# EAGLE design SMART LOCK UK (EAGLE 6.4)
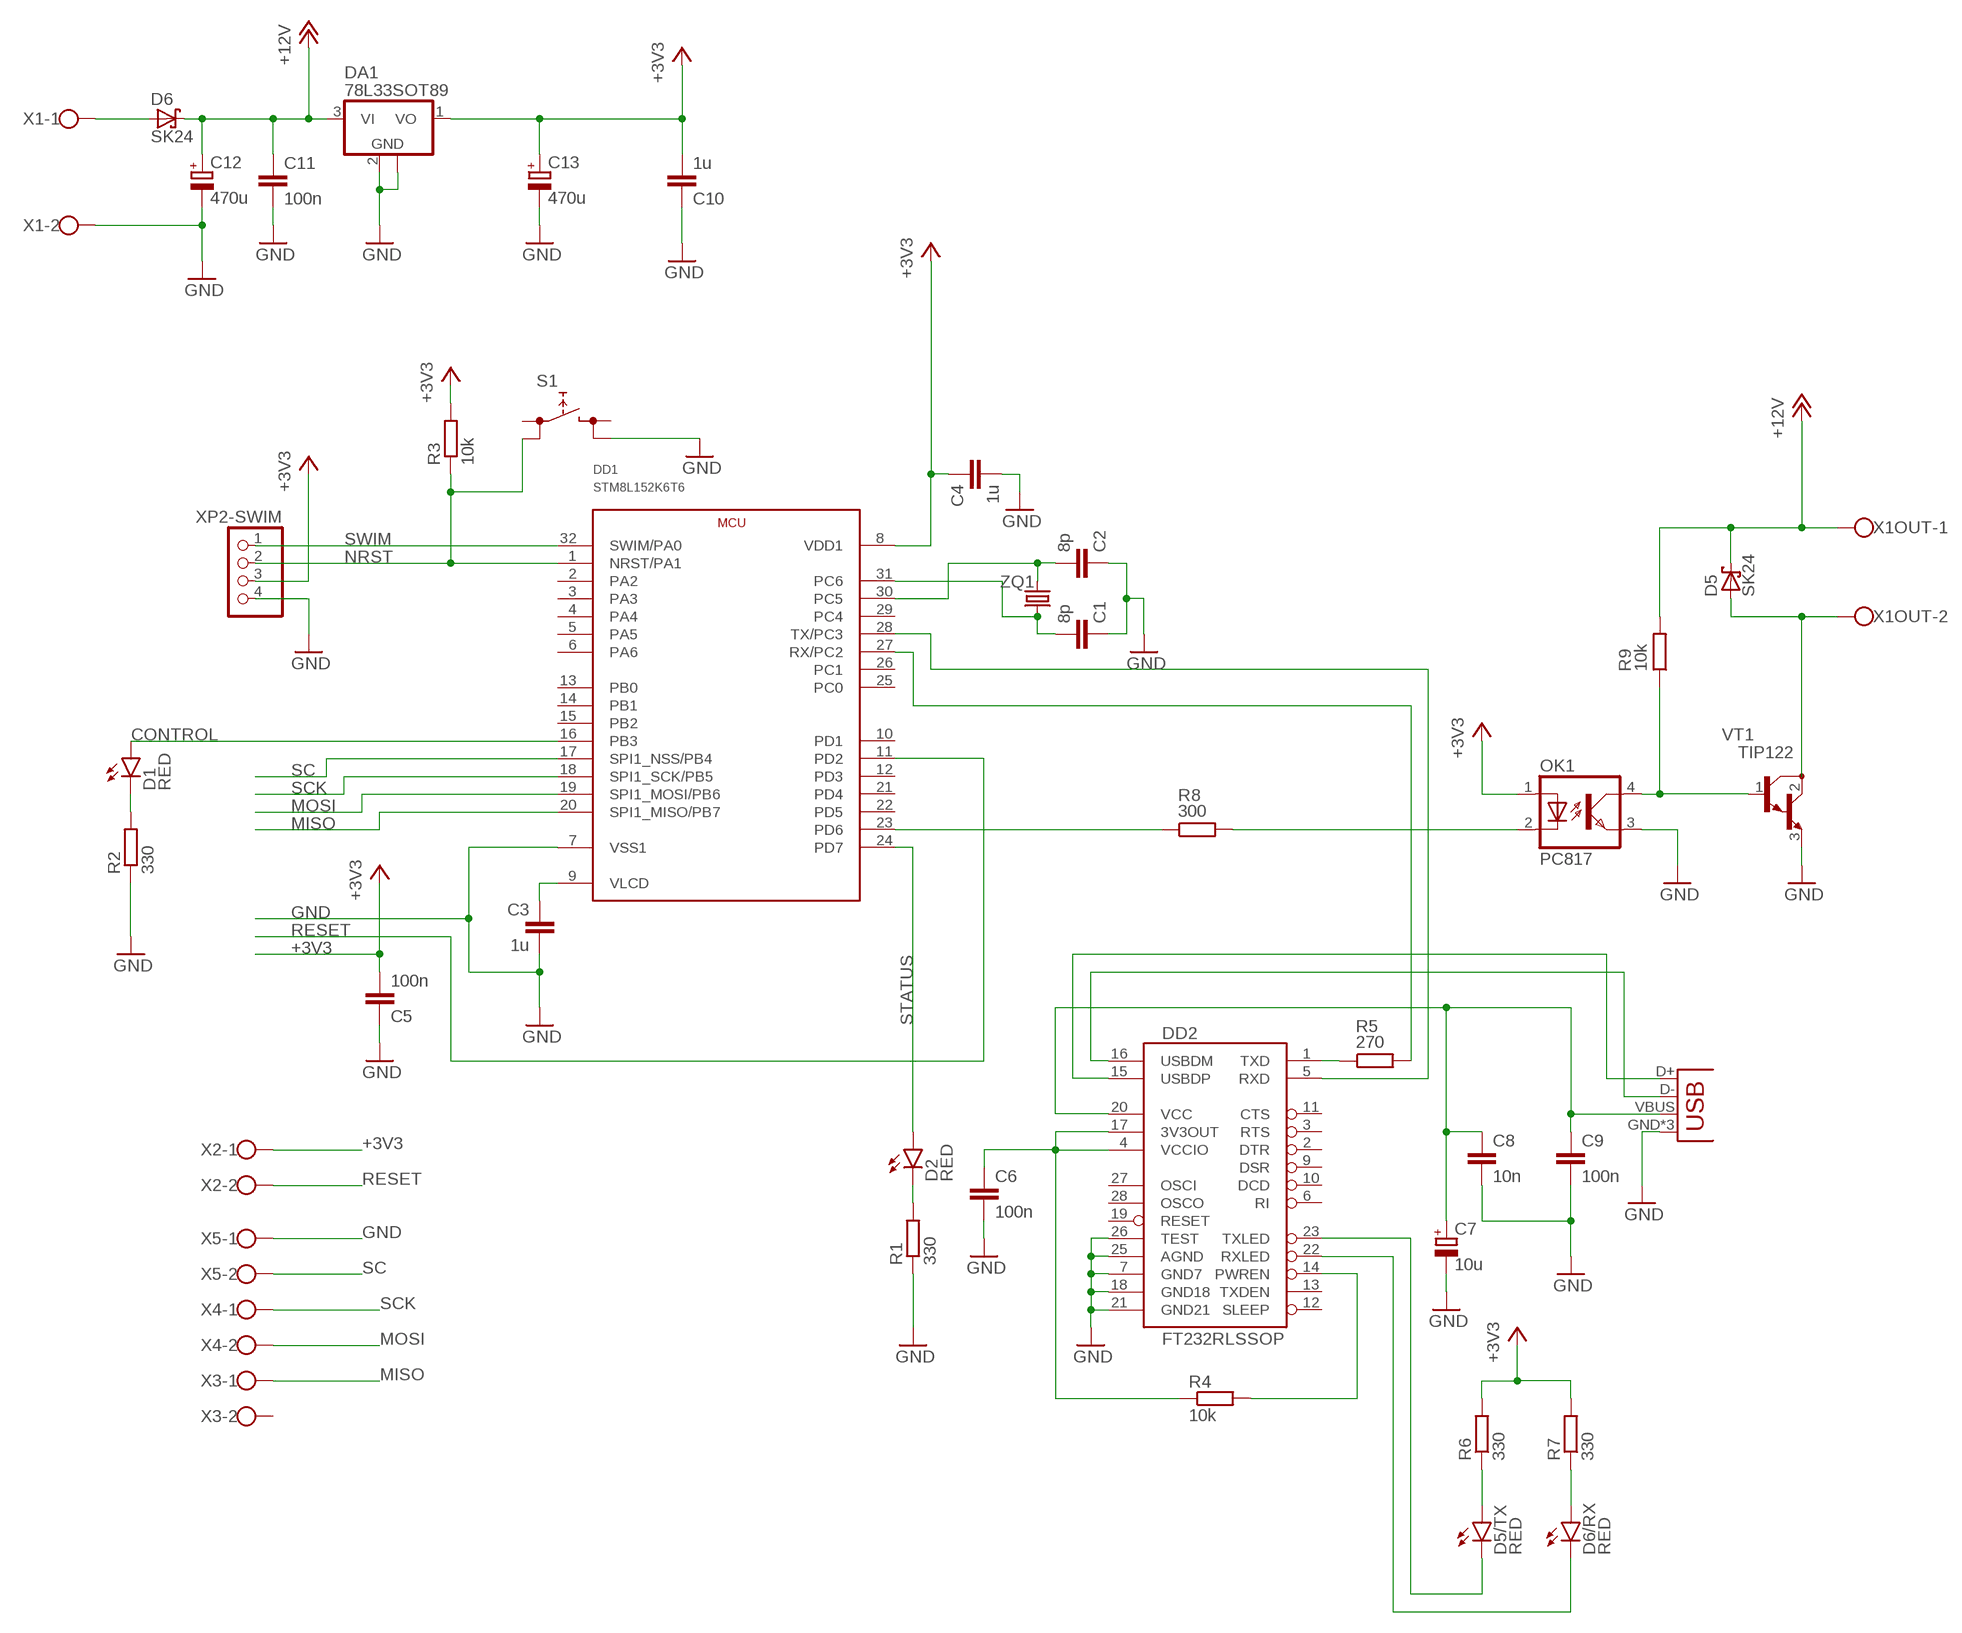
[diagram p0: schematic, sheet 1]

## Parts
C1  8p  C-EUC1206  [C1206]
C2  8p  C-EUC1206  [C1206]
C3  1u  C-EUC1206  [C1206]
C4  1u  C-EUC1206  [C1206]
C5  100n  C-EUC1206  [C1206]
C6  100n  C-EUC1206  [C1206]
C7  10u  CPOL-EUE2,5-5  [E2,5-5]
C8  10n  C-EUC1206  [C1206]
C9  100n  C-EUC1206  [C1206]
C10  1u  C-EUC1206  [C1206]
C11  100n  C-EUC1206  [C1206]
C12  470u  CPOL-EUE3,5-8  [E3,5-8]
C13  470u  CPOL-EUE3,5-8  [E3,5-8]
D1  RED  LED-RED1206  [LED-1206]
D2  RED  LED-RED1206  [LED-1206]
D5  SK24  SCHOTTKY-DIODESMD  [SMB]
D5/TX  RED  LED-RED1206  [LED-1206]
D6  SK24  SCHOTTKY-DIODESMD  [SMB]
D6/RX  RED  LED-RED1206  [LED-1206]
DA1  78L33SOT89  [SOT89]
DD1  STM8L152K6T6  [LQFP32-7X7]
DD2  FT232RLSSOP  [SSOP28DB]
JP1  USB-B  USB-B-CROW  [USB-B-PTH]
OK1  PC817  [DIL04]
R1  330  R-EU_LM1206  [M1206]
R2  330  R-EU_LM1206  [M1206]
R3  10k  R-EU_LM1206  [M1206]
R4  10k  R-EUM1206  [M1206]
R5  270  R-EUM1206  [M1206]
R6  330  R-EU_LM1206  [M1206]
R7  330  R-EU_LM1206  [M1206]
R8  300  R-EUM1206  [M1206]
R9  10k  R-EUM1206  [M1206]
S1  TACKT_SW_TH  [TL1105]
VT1  TIP122  [TO220]
X1  W237-102  [W237-102]
X1OUT  W237-102  [W237-102]
X2  DG350-3.5-02P  [DG350-3.5-02P]
X3  DG350-3.5-02P  [DG350-3.5-02P]
X4  DG350-3.5-02P  [DG350-3.5-02P]
X5  DG350-3.5-02P  [DG350-3.5-02P]
XP2-SWIM  PINHD-1X4  [1X04]
ZQ1  CRYSTAL1MM20SS  [MM20SS]

## Nets
+3V3: C4.1 C5.2 C10.2 C13.+ DA1.1(VO) DD1.8(VDD1) OK1.1(A) R3.2 R6.2 R7.2 X2.1 XP2-SWIM.3
+12V: C11.1 C12.+ D5.C D6.C DA1.3(VI) R9.2 X1OUT.1
CONTROL: D1.A DD1.16(PB3)
GND: C1.1 C2.1 C3.2 C4.2 C5.1 C6.2 C7.- C8.2 C9.2 C10.1 C11.2 C12.- C13.- DA1.2(GND) DA1.2@1(GND) DD1.7(VSS1) DD2.7(GND7) DD2.18(GND18) DD2.21(GND21) DD2.25(AGND) DD2.26(TEST) JP1.GND JP1.S1(GND) JP1.S2(GND) OK1.3(EMIT) R1.1 R2.1 S1.4 VT1.3(E) X1.2 X5.1 XP2-SWIM.4
MISO: DD1.20(SPI1_MISO/PB7) X3.1
MOSI: DD1.19(SPI1_MOSI/PB6) X4.2
N$1: DD1.28(TX/PC3) DD2.5(RXD)
N$2: C1.2 DD1.31(PC6) ZQ1.1
N$3: C3.1 DD1.9(VLCD)
N$6: D5/TX.A R6.1
N$7: D6/RX.A R7.1
N$8: D5/TX.C DD2.23(TXLED)
N$9: D6/RX.C DD2.22(RXLED)
N$10: D5.A VT1.2(C) X1OUT.2
N$11: D2.C R1.2
N$12: D1.C R2.2
N$13: OK1.4(COL) R9.1 VT1.1(B)
N$14: OK1.2(C) R8.2
N$15: DD1.23(PD6) R8.1
N$16: D6.A X1.1
N$17: C7.+ C8.1 C9.1 DD2.20(VCC) JP1.VBUS
N$18: DD1.27(RX/PC2) R5.2
N$19: C2.2 DD1.30(PC5) ZQ1.4
N$25: DD2.16(USBDM) JP1.D-
N$26: DD2.15(USBDP) JP1.D+
N$27: C6.1 DD2.4(VCCIO) DD2.17(3V3OUT) R4.1
N$29: DD2.14(PWREN) R4.2
N$30: DD2.1(TXD) R5.1
NRST: DD1.1(NRST/PA1) R3.1 S1.3 XP2-SWIM.2
RESET: DD1.11(PD2) X2.2
SC: DD1.17(SPI1_NSS/PB4) X5.2
SCK: DD1.18(SPI1_SCK/PB5) X4.1
STATUS: D2.A DD1.24(PD7)
SWIM: DD1.32(SWIM/PA0) XP2-SWIM.1
Unconnected: DD1.2(PA2) DD1.3(PA3) DD1.4(PA4) DD1.5(PA5) DD1.6(PA6) DD1.10(PD1) DD1.12(PD3) DD1.13(PB0) DD1.14(PB1) DD1.15(PB2) DD1.21(PD4) DD1.22(PD5) DD1.25(PC0) DD1.26(PC1) DD1.29(PC4) DD2.2(DTR) DD2.3(RTS) DD2.6(RI) DD2.9(DSR) DD2.10(DCD) DD2.11(CTS) DD2.12(SLEEP) DD2.13(TXDEN) DD2.19(RESET) DD2.27(OSCI) DD2.28(OSCO) S1.1 S1.2 X3.2

## Library data of the parts
C1-C5 C10 = SMART LOCK UK:C-EU
C6 C8 C9 C11 = CondAdapt:C-EU
C7 C12 C13 = LAMP_RES:CPOL-EU
D1 D2 D5/TX D6/RX = SMART LOCK UK:LED-RED: Assorted Red LEDs LilyPad 1206- DIO-09912 1206- DIO-00809 0603- DIO-00819; PROD_ID: DIO-00809
D5 D6 = NOVOSIB:SCHOTTKY-DIODE: Schottky Diode
DA1 = SMART LOCK UK:78L33SOT89
DD1 = SMART LOCK UK:STM8L152K6T6
DD2 = Bullet_cont_prom:FT232RL: USB UART FT232RL 4th Generation USB UART (USB <-> Serial) Controller. Spark Fun Electronics SKU : COM-00650 Production SKU IC-00870; PROD_ID: IC-00870
JP1 = Bullet_cont_prom:USB-B-CROW
OK1 = SMART LOCK UK:PC817: SHARP OPTO COUPLER; MPN: PC817X4J000F; OC_FARNELL: 9707727; OC_NEWARK: 97K7059
R1-R3 R6 R7 = SMART LOCK UK:R-EU_L: RESISTOR, European symbol
R4 R5 R8 R9 = CondAdapt:R-EU: RESISTOR, European symbol
S1 = SMART LOCK UK:TACKT_SW: PUSH SWITCH ITT-Cannon-Cannon
VT1 = SMART LOCK UK:TIP122: NPN BIPOLAR DARLINGTON TRANSISTOR
X1 X1OUT = SMART LOCK UK:W237-102: WAGO SCREW CLAMP; MPN: 237-102; OC_FARNELL: unknown; OC_NEWARK: 70K9898
X2-X5 = LASER_CONTROL_LIB:DG350-3.5-02P: WAGO SCREW CLAMP; MPN: 237-102; OC_FARNELL: unknown; OC_NEWARK: 70K9898
XP2-SWIM = SMART LOCK UK:PINHD-1X4: PIN HEADER
ZQ1 = SMART LOCK UK:CRYSTAL1: CRYSTAL; OC_FARNELL: unknown; OC_NEWARK: unknown

## Board
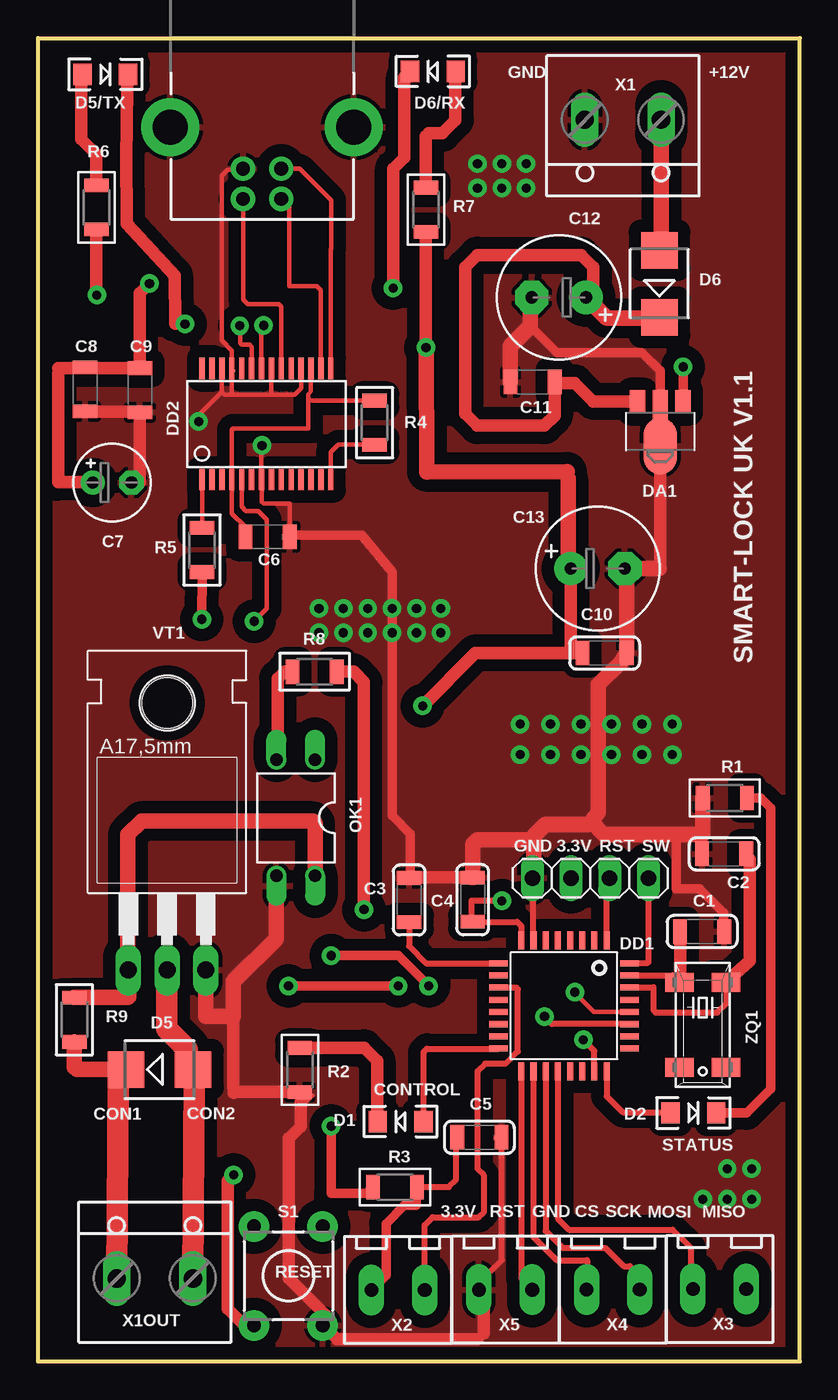
[diagram p1: board, top side]
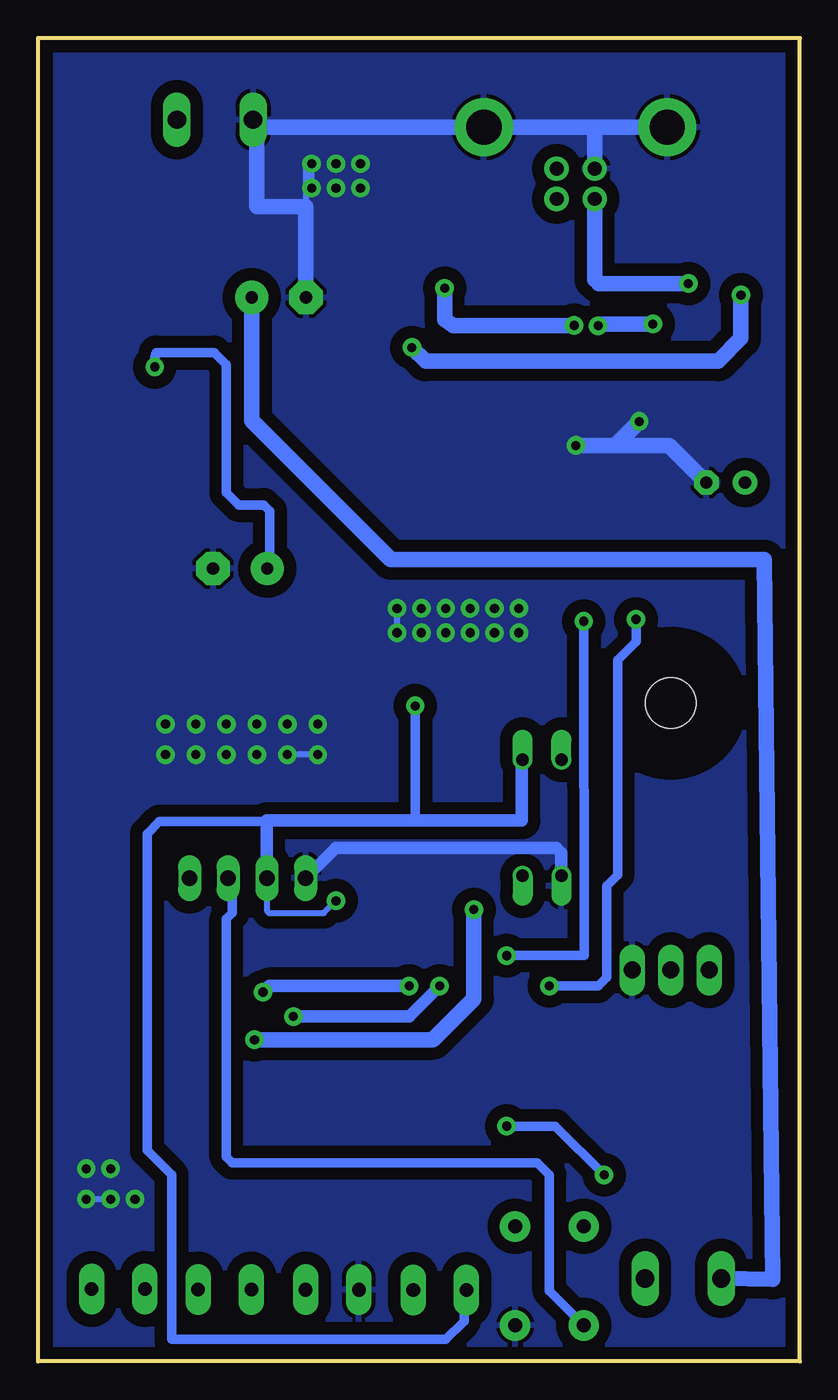
[diagram p2: board, bottom side, seen from below]

Size 50 x 86.9 mm. Coordinates in mm from the lower left corner, seen from the top.
Outline: 0,0 50,0 50,86.9 0,86.9 0,0
Copper layers (1*16): Top 0.035mm / dielectric 1.5mm / Bottom 0.035mm
Design rules "default *": minimum track width 0.25mm, minimum drill 15mil, track to track 8mil, track to pad 8mil, pad to pad 8mil, via to via 8mil, smd to smd 8mil, copper to edge 28mil, drill to drill 28mil, minimum pad ring 10mil, minimum via ring 12mil, stop-mask expansion 4mil, vias tented up to drill 0mil, thermal gap 10mil

### Footprints (pad centres in the part's own frame; a part is rotated, then mirrored left to right if it is on the bottom)
C1206 = smd 0.9 x 1.6: 1 -1.45,0; 2 1.45,0
E2,5-5 = drill 0.8 pad 1.6: + -1.27,0 | drill 0.8 pad 1.6 octagon: - 1.27,0
E3,5-8 = drill 0.8 pad 2.184: + -1.778,0 | drill 0.8 pad 2.184 octagon: - 1.778,0
LED-1206 = smd 1.2 x 1.4: A -1.5,0; C 1.5,0
SMB = smd 2.4 x 2.4: A 2.2,0; C -2.2,0
SOT89 = smd 1 x 1.5: 1 -1.499,-1.981; 3 1.499,-1.981 | smd 1 x 2: 2 0,-1.727 | smd 2.2 x 3.7: 2@1 0,0.94
LQFP32-7X7 = smd 1.2 x 0.4: 1 -4.3,2.8; 2 -4.3,2; 3 -4.3,1.2; 4 -4.3,0.4; 5 -4.3,-0.4; 6 -4.3,-1.2; 7 -4.3,-2; 8 -4.3,-2.8; 17 4.3,-2.8; 18 4.3,-2; 19 4.3,-1.2; 20 4.3,-0.4; 21 4.3,0.4; 22 4.3,1.2; 23 4.3,2; 24 4.3,2.8 | smd 0.4 x 1.2: 9 -2.8,-4.3; 10 -2,-4.3; 11 -1.2,-4.3; 12 -0.4,-4.3; 13 0.4,-4.3; 14 1.2,-4.3; 15 2,-4.3; 16 2.8,-4.3; 25 2.8,4.3; 26 2,4.3; 27 1.2,4.3; 28 0.4,4.3; 29 -0.4,4.3; 30 -1.2,4.3; 31 -2,4.3; 32 -2.8,4.3
SSOP28DB = smd 0.348 x 1.397: 1 -4.225,-3.656; 2 -3.575,-3.656; 3 -2.925,-3.656; 4 -2.275,-3.656; 5 -1.625,-3.656; 6 -0.975,-3.656; 7 -0.325,-3.656; 8 0.325,-3.656; 9 0.975,-3.656; 10 1.625,-3.656; 11 2.275,-3.656; 12 2.925,-3.656; 13 3.575,-3.656; 14 4.225,-3.656; 15 4.225,3.656; 16 3.575,3.656; 17 2.925,3.656; 18 2.275,3.656; 19 1.625,3.656; 20 0.975,3.656; 21 0.325,3.656; 22 -0.325,3.656; 23 -0.975,3.656; 24 -1.625,3.656; 25 -2.275,3.656; 26 -2.925,3.656; 27 -3.575,3.656; 28 -4.225,3.656
USB-B-PTH = drill 0.9 pad 1.6: D+ 0,1.25; D- 1.981,1.25; GND 0,-1.25; VBUS 1.981,-1.25 | drill 2.3 pad 3.81: S1 -2.718,-6.02; S2 -2.718,6.02
DIL04 = drill 0.813 offset: 1 -1.27,-3.81; 2 1.27,-3.81; 3 1.27,3.81; 4 -1.27,3.81
M1206 = smd 0.9 x 1.6: 1 -1.45,0; 2 1.45,0
TL1105 = drill 0.9 pad 2: 1 -2.25,3.25; 2 2.25,3.25; 3 -2.25,-3.25; 4 2.25,-3.25
TO220 = drill 1.118 long: 1 -2.54,-6.35; 2 0,-6.35; 3 2.54,-6.35 | hole 3.302: 0,11.176
W237-102 = drill 1.2 long: 1 -2.5,-1.27; 2 2.5,-1.27
DG350-3.5-02P = drill 0.9 pad 1.676 long: 1 -1.75,0; 2 1.75,0
1X04 = drill 1.016 long: 1 -3.81,0; 2 -1.27,0; 3 1.27,0; 4 3.81,0
MM20SS = smd 1.27 x 1.88: 1 -2.794,-1.524; 2 2.794,-1.524; 3 2.794,1.524; 4 -2.794,1.524

### Placement (x,y rotation side)
C1  43.59,28.23 180 top
C2  45.04,33.33 0 top
C3  24.36,30.3 90 top
C4  28.53,30.32 90 top
C5  28.97,14.72 180 top
C6  15.07,54.15 0 top
C7  4.86,57.71 0 top
C8  3.09,63.83 270 top
C9  6.69,63.78 270 top
C10  37.19,46.52 180 top
C11  32.46,64.32 180 top
C12  34.19,69.87 180 top
C13  36.74,52.07 0 top
D1  23.8,15.75 180 top
D2  43.01,16.32 0 top
D5  7.98,19.17 0 top
D5/TX  4.41,84.52 0 top
D6  40.79,70.77 90 top
D6/RX  25.92,84.71 180 top
DA1  40.84,61.05 180 top
DD1  34.52,23.35 270 top
DD2  14.99,61.56 0 top
JP1  14.71,78.32 270 top
OK1  16.92,35.7 180 top
R1  45.08,37 0 top
R2  17.18,19.14 90 top
R3  23.43,11.45 0 top
R4  22.09,61.64 270 top
R5  10.76,53.29 270 top
R6  3.83,75.78 270 top
R7  25.46,75.63 270 top
R8  18.15,45.3 180 top
R9  2.38,22.44 270 top
S1  16.43,5.62 0 top
VT1  8.47,32.05 0 top
X1  38.39,80.27 180 top
X1OUT  7.66,6.72 0 top
X2  23.63,4.69 0 top
X3  44.74,4.76 0 top
X4  37.75,4.72 0 top
X5  30.69,4.71 0 top
XP2-SWIM  36.25,31.74 180 top
ZQ1  43.63,22.1 270 top

### Tracks (layer width: path | path; a pad name or v marks a point on that pad's centre or on a via)
+3V3  (via drill 0.6)
  Top 0.25: 24.84,11.45 R3.2
  Top 0.305: 3.83,70.06 v3.86,70.03 | v25.47,66.57 v25.46,66.58 | 34.86,58.46 34.79,57.96 | 34.79,52.24 C13.+
  Top 0.406: v25.46,66.58 25.49,66.56 | 34.73,58.43 34.79,57.96 | DD1.8 31.72,28.59 31.44,28.87 C4.1 28.44,28.96 28.44,30.25 v30.44,30.25 | 24.79,11.36 R3.2 26.96,11.45 27.44,11.93 27.44,14.64 C5.2 | 34.96,46.5 C10.2
  Top 0.61: DA1.1 42.34,64.95 v42.34,65.31 | R3.2 24.84,11.41 24.84,10.25 24.04,10.25 22.84,9.05 22.84,5.65 X2.1
  Top 0.813: R6.2 3.83,70.06 | v25.46,66.58 R7.2 | C13.+ 34.96,46.5 | C10.2 28.71,46.52 v25.24,43.05
  Top 1.016: 34.79,57.96 34.79,52.24 | 25.49,66.56 25.52,58.41 34.73,58.43 | C13.+ 34.64,52.07
  Bottom 0.25: OK1.1 18.44,39.45 18.24,39.45 | 35.24,35.45 34.98,35.51
  Bottom 0.406: 25.24,35.91 25.64,35.51 | XP2-SWIM.3 34.98,29.59 34.84,29.45 31.24,29.45 v30.44,30.25
  Bottom 0.61: v42.34,65.31 42.34,65.88 42.25,66.25 38.44,66.25 37.64,65.45 37.64,57.05 36.84,56.25 35.19,56.25 34.79,55.85 34.79,52.24 C13.+ | v25.24,43.05 25.24,35.91 | 35.24,35.45 42.04,35.45 42.84,34.65 42.84,13.85 41.24,12.25 41.24,1.45 23.24,1.45 22.04,2.65 22.04,4.53 X2.1
  Bottom 0.813: XP2-SWIM.3 34.98,35.51 25.64,35.51 19.16,35.51 18.24,35.52 18.24,39.45 18.24,39.46
  Bottom 1.016: v3.86,70.03 3.86,67.18 5.36,65.68 24.56,65.68 v25.46,66.58
+12V
  Top 0.305: 37.65,68.51 37.64,68.52 | C11.1
  Top 0.61: 5.25,18.64 D5.C | 2.54,19.17 2.39,19.32 | R9.2 | 41.64,67.72 D6.C | 36.44,70.34 C12.+
  Top 0.813: 40.74,68.52 D6.C | 36.44,70.34 36.44,71.85 35.64,72.65 28.84,72.65 28.04,71.85 28.04,62.25 28.84,61.45 33.24,61.45 33.91,62.12 C11.1 33.98,64.25 35.24,64.25 36.46,63.03 DA1.3
  Top 1.016: D5.C 2.54,19.17 | 2.39,19.32 R9.2 | 40.74,68.52 37.64,68.52 37.32,68.52 C12.+
  Top 1.422: X1OUT.1 5.25,18.64
  Bottom 1.016: C12.+ 35.97,61.78 26.84,52.65 2.33,52.65 1.79,5.39 X1OUT.1
CONTROL
  Top 0.406: D1.A 25.3,20.32 25.52,20.54 DD1.16
GND  (via drill 0.6)
  Top 0.25: 30.04,14.65 C5.1 | 16.84,54.25 C6.2 | 24.04,31.85 C3.2 | 18.04,17.45 17.64,17.45 17.24,17.45 R2.1 | 12.72,65.05 12.84,65.05 DD2.25 | 18.84,2.65 S1.4
  Top 0.305: 32.44,69.84 C12.- 32.32,69.78 | 24.38,31.77 C3.2 | C6.2 16.52,56.31 16.51,56.32 14.82,56.32 14.67,56.42 14.67,57.85 DD2.7 14.66,60.12 | DD2.26 12.06,63.67 | 12.06,63.67 12.23,63.5 12.83,63.5 | 12.83,63.5 15.31,63.5 | 15.31,63.5 16.86,63.5 17.27,63.93 17.27,65.17 DD2.18 | 12.72,65.2 12.72,65.05 12.72,63.63 12.83,63.5 | DD2.21 15.31,63.51 15.31,63.5 | v10.54,61.72 10.54,62.14 12.06,63.67 | DD2.25 12.71,66.38 12.04,67.05 12.04,77.85 12.44,78.25 13.39,78.25 JP1.GND
  Top 0.406: C9.2 6.69,62.38 | 12.9,17.69 12.86,17.65 | DD1.7 32.52,31.66 XP2-SWIM.4 | S1.4 18.72,2.37 | 28.84,1.45 29.24,1.85 | 24.44,31.83 C3.2 | X5.1 28.94,5.15 30.44,6.65 30.44,14.7 C5.1
  Top 0.61: 36.31,35.45 36.12,35.25 | 32.55,34.51 32.55,34.25 | 32.41,31.77 XP2-SWIM.4 | C1.1 45.02,28.25 45.02,29.44 43.44,31.02 41.88,31.02 41.88,34.62 | C2.1 43.63,34.62 | 12.84,17.63 12.86,17.65 | 6.69,57.71 C7.- | 40.84,52.12 40.79,52.07 | DA1.2@1 DA1.2 40.84,65.05 39.64,66.25 34.04,66.25 32.32,67.97 | 16.84,54.25 21.24,54.25 23.24,51.85 v23.24,49.45 v23.24,47.85 23.24,35.85 24.44,34.65 24.44,31.83
  Top 0.813: C9.2 6.69,57.71 | 6.69,62.38 C8.2 | 32.55,31.85 XP2-SWIM.4 | C4.2 24.38,31.77 | R2.1 12.9,17.69 | 12.86,17.65 12.82,18.21 12.83,22.66 | DA1.2@1 40.84,52.12 | 18.72,2.37 19.64,1.45 28.84,1.45 | 29.24,1.85 29.24,4.41 X5.1 | 18.84,2.65 18.84,3.05 16.44,5.45 16.44,14.65 17.24,15.45 17.24,17.05 17.64,17.45
  Top 1.016: 40.79,52.07 C13.- 38.64,51.95 C10.1 38.24,45.9 36.78,44.44 36.78,36.04 36.31,35.45 37.14,34.62 41.88,34.62 43.63,34.62 R1.1 | OK1.3 15.65,28 15.64,27.99 15.64,27.76 12.83,24.95 12.83,22.66 | 36.12,35.25 33.29,35.25 32.55,34.51 | 32.55,31.85 32.55,34.25 28.84,34.25 28.53,33.94 C4.2 | C11.2 31.01,66.66 32.32,67.97 32.32,69.78 | VT1.3 11.01,22.66 12.83,22.66 | 12.83,22.66
  Bottom 0.406: 13.46,80.86 13.64,81.04 | v31.64,39.85 v33.64,39.85 | v26.44,49.45 v26.44,47.85 | v45.24,10.65 v46.84,10.65 | v32.04,77.05 v32.04,78.65 32.44,78.65 32.44,75.85
  Bottom 0.813: OK1.3 15.65,33.38 15.99,33.72 30.46,33.72 XP2-SWIM.4
  Bottom 1.016: 36.19,81.24 X1.2 | C7.- 8.57,60.15 v14.7,60.15 12.11,60.15 v10.54,61.72 | C12.- 32.44,69.87 32.44,75.84 35.63,75.84 35.64,75.85 35.64,81.29 X1.2 | JP1.S1 13.64,81.04 JP1.S2 35.39,81.04 X1.2 | JP1.GND 13.46,80.86
  other vias: 31.64,41.85 33.64,41.85 35.64,41.85 37.64,41.85 39.64,41.85 41.64,41.85 41.64,39.85 39.64,39.85 37.64,39.85 35.64,39.85 18.44,49.45 18.44,47.85 20.04,49.45 20.04,47.85 21.64,49.45 21.64,47.85 24.84,49.45 24.84,47.85 45.24,12.65 46.84,12.65 43.64,10.65 28.84,78.65 30.44,78.65 28.84,77.05 30.44,77.05
  pour Bottom (isolate 0.813): 0.44,86.25 49.24,86.25 49.24,0.65 0.44,0.65
  pour Top (isolate 0.813): 0.44,86.25 49.24,86.25 49.24,0.65 0.44,0.65
MISO
  Top 0.406: DD1.20 34.12,9.37 34.84,8.65 41.64,8.65 42.84,7.45 42.84,4.91 X3.1
MOSI
  Top 0.406: DD1.19 33.32,8.57 34.44,7.45 37.24,7.45 38.44,6.25 38.84,6.25 39.64,5.45 39.64,4.86 X4.2
N$1  (via drill 0.6)
  Top 0.305: DD2.5 13.36,56.12 13.64,55.85 14.44,55.85 15.02,55.27 15.02,49.44 v14.18,48.6 | v35.24,24.25 35.24,24.2 36.48,22.96 DD1.28
  Top 0.61: v19.24,26.65 23.64,26.65 v25.64,24.65
  Bottom 0.61: v14.18,48.6 14.15,26.65 v19.24,26.65
  Bottom 0.813: v25.64,24.65 34.84,24.65 v35.24,24.25
N$2
  Top 0.406: 42.14,24.93 ZQ1.1 41.65,25.35 DD1.31
  Top 0.813: C1.2 42.14,24.93
N$3
  Top 0.406: C3.1 24.36,27.27 25.48,26.15 DD1.9
N$6
  Top 0.406: 2.84,84.45 D5/TX.A
  Top 0.813: R6.1 3.83,79.26 2.84,80.25 2.84,84.45
N$7
  Top 0.406: 27.4,84.69 D6/RX.A
  Top 0.813: R7.1 25.46,80.47 25.64,80.65 26.54,80.65 27.4,81.51 27.4,84.69
N$8  (via drill 0.6)
  Top 0.25: DD2.23 14.04,65.45 14.01,65.45
  Top 0.305: 14.01,65.38 14.01,65.45 14.01,66.62 13.91,66.76 13.38,66.76 13.27,66.87 13.27,67.85 | 13.27,67.85 13.27,68.07 | v13.24,68.01 13.24,67.88 13.27,67.85
  Top 0.406: 5.84,84.45 D5/TX.C
  Top 0.813: v9.64,68.12 8.99,68.15 8.97,71.3 5.83,74.71 5.8,79.48 5.83,80.79 5.83,81.99 5.84,82.85 5.84,84.45
  Bottom 0.406: 13.13,68.12 v13.24,68.01
  Bottom 1.016: v9.64,68.12 13.13,68.12
N$9  (via drill 0.6)
  Top 0.305: DD2.22 14.66,68.06 14.78,68.06 v14.81,68.03
  Top 0.813: v23.31,70.48 v23.32,70.49 23.32,78.33 24.04,79.05 24.04,84.33 D6/RX.C
  Bottom 1.016: v14.81,68.03 22.74,68.03 23.32,68.4 v23.31,70.48
N$10
  Top 0.25: VT1.2 8.44,25.85 8.44,25.67
  Top 0.61: 10.25,18.68 9.64,19.29 10.06,19.29 D5.A 9.79,19.56
  Top 1.422: X1OUT.2 10.25,18.68 | 9.79,19.56 9.79,20.49 8.44,21.84 8.44,25.67
N$11
  Top 0.305: D2.C
  Top 0.61: R1.2 47.43,37 48.08,36.35 48.08,17.89 46.51,16.32 D2.C
N$12
  Top 0.406: 22.26,15.79 D1.C
  Top 0.813: R2.2 21.41,20.59 22.26,19.74 22.26,15.79
N$13
  Top 0.25: VT1.1 6.04,25.85 5.89,25.85
  Top 1.016: OK1.4 18.19,35.34 18.04,35.49 6.79,35.49 5.89,34.59 5.89,25.85 5.89,25.74 | R9.1 5.88,23.89 5.94,23.95 VT1.1
N$14
  Top 0.305: 15.73,39.59 OK1.2
  Top 0.813: R8.2 16.18,45.3 15.73,44.85 15.73,39.59
N$15  (via drill 0.6)
  Top 0.305: R8.1
  Top 0.406: DD1.23 36.52,20.39 v35.79,21.12
  Top 0.813: v21.39,29.67 21.39,44.61 20.71,45.29 R8.1
  Bottom 1.016: v35.79,21.12 24.09,21.12 21.39,23.82 v21.39,29.67
N$16
  Top 0.61: 40.89,73.07 D6.A
  Top 1.016: X1.1 40.89,73.07
N$17  (via drill 0.6)
  Top 0.305: JP1.VBUS 13.46,69.73 13.76,69.43 15.81,69.43 15.97,69.27 DD2.20
  Top 0.406: 3.09,65.23 C8.1 3.04,65.23 | C7.+ 3.59,57.73
  Top 0.61: 1.34,64.91 1.32,65.23
  Top 0.813: 3.09,65.23 C9.1 6.69,70.16 v7.31,70.78 | 3.59,57.73 1.32,57.73 1.34,58.46 1.34,64.91 | 1.32,65.23 3.04,65.23
  Bottom 0.813: 13.19,70.78 13.46,71.05
  Bottom 1.016: v7.31,70.78 13.19,70.78 | 13.46,71.05 JP1.VBUS
N$18  (via drill 0.6)
  Top 0.406: DD1.27 33.74,22.15 v33.24,22.65
  Top 0.61: v23.64,24.65 v16.44,24.65 | v10.75,48.73 R5.2
  Bottom 0.61: 10.67,48.65 v10.75,48.73 10.75,47.27 11.96,46.06 11.96,31.96 12.68,31.24 12.68,25.21 13.24,24.65 v16.44,24.65
  Bottom 0.813: v33.24,22.65 25.64,22.65 v23.64,24.65
N$19
  Top 0.406: DD1.30 40.37,24.55 40.39,24.57 40.39,23.07 40.54,22.92 44.59,22.92 45.19,23.52 45.19,24.86 ZQ1.4
  Top 0.813: C2.2 46.7,32.96 46.7,26.3 ZQ1.4
N$25
  Top 0.305: DD2.16 18.56,70.34 18.29,70.61 16.5,70.61 16.49,75.81 JP1.D-
N$26
  Top 0.305: DD2.15 19.21,72.99 19.24,73.08 19.24,76.25 17.17,78.32 JP1.D+
N$27
  Top 0.305: C6.1 13.62,54.78 12.72,55.68 DD2.4 12.71,61.2 12.79,61.27 17.74,61.27 17.74,63.25 | 17.74,63.25 17.74,63.49 17.91,63.73 DD2.17 | R4.1 17.95,63.09 17.74,63.25
N$29
  Top 0.305: R4.2 19.69,60.19 19.22,59.72 DD2.14
N$30
  Top 0.305: DD2.1 R5.1
  Top 0.406: R5.1
NRST  (via drill 0.6)
  Top 0.406: DD1.1 37.32,31.54 XP2-SWIM.2
  Top 0.61: v19.24,15.45 19.24,11.05 21.58,11.05 R3.1
  Top 0.813: S1.3 13.52,2.37 12.44,3.45 12.44,11.85 v12.84,12.25
  Bottom 0.25: 37.24,31.45 XP2-SWIM.2 | 14.44,2.65 S1.3
  Bottom 0.61: 14.44,2.65 16.44,4.65 16.44,12.25 17.24,13.05 37.24,13.05 37.64,13.45 37.64,29.05 37.24,29.45 37.24,31.46 XP2-SWIM.2 | v12.84,12.25 16.04,15.45 v19.24,15.45
RESET
  Top 0.305: DD1.11
  Top 0.406: DD1.11 31.39,24.54 31.49,24.44 31.49,20.33 31.47,20.33 30.69,19.55 29.34,19.55 28.84,19.05 28.84,12.65 29.24,12.25 29.24,9.77 28.94,9.47 25.9,9.47 25.38,8.95 X2.2
SC
  Top 0.406: DD1.17 31.72,5.43 X5.2
SCK
  Top 0.406: DD1.18 32.52,8.17 34.04,6.65 36.04,6.65 36.04,4.76 X4.1
STATUS
  Top 0.406: DD1.24 37.32,17.42 38.38,16.36 41.47,16.36 D2.A
SWIM
  Top 0.305: 40.06,26.23 39.98,26.15
  Top 0.406: XP2-SWIM.1 40.06,26.23 | 39.98,26.15 DD1.32

### Text on the board
tNames: GND | +12V | SMART-LOCK UK V1.1 | GND | 3.3V | RST | SW | CONTROL | CON1 | CON2 | STATUS | 3.3V | RST | GND | CS | SCK | MOSI | MISO | RESET